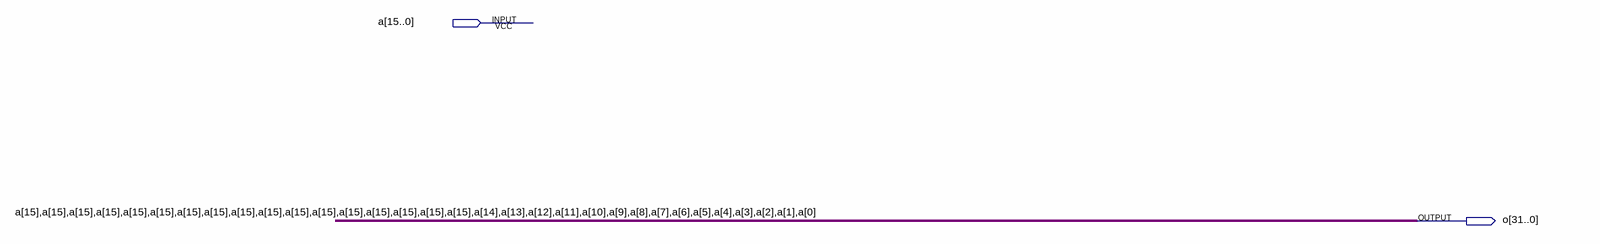
[diagram p0: schematic sheet]
// Quartus schematic se.bdf as structural Verilog: 0 symbols, 2 pins
module se (
  input  [15:0] a,
  output [31:0] o
);


  assign o = {{17{a[15]}}, a[14:0]};
endmodule
